# EAGLE design CNYboard (EAGLE 9.5.1)
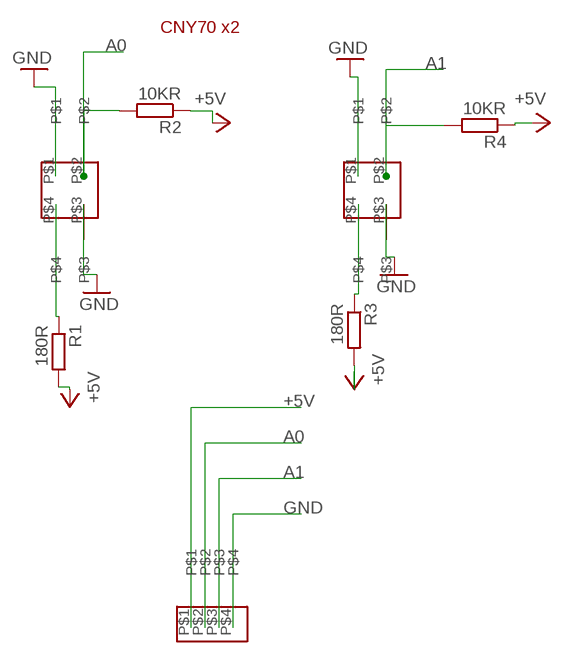
[diagram p0: schematic, sheet 1]

## Parts
R1  180R  R-EU_R0603  [R0603]
R2  10KR  R-EU_R0603  [R0603]
R3  180R  R-EU_R0603  [R0603]
R4  10KR  R-EU_R0603  [R0603]
U$1  CNYSOKET  [CNYSOKET]
U$2  CNYSOKET  [CNYSOKET]
U$3  PIN4  [PIN4]

## Nets
+5V [usbvcc]: R1.2 R2.1 R3.2 R4.1 U$3.P$1
A0: R2.2 U$1.P$2 U$3.P$2
A1: R4.2 U$2.P$2 U$3.P$3
GND: U$1.P$1 U$1.P$3 U$2.P$1 U$2.P$3 U$3.P$4
N$1: R1.1 U$1.P$4
N$2: R3.1 U$2.P$4

## Notes on the sheet
- CNY70 x2

## Library data of the parts
R1-R4 = rcl:R-EU_: RESISTOR, European symbol; SPICEPREFIX: R
U$1 U$2 = cnysoket:CNYSOKET
U$3 = PIN4:PIN4

## Net classes
3 usbvcc: width 0.254 mm, drill 0.61 mm, clearance 0.254 mm

## Board
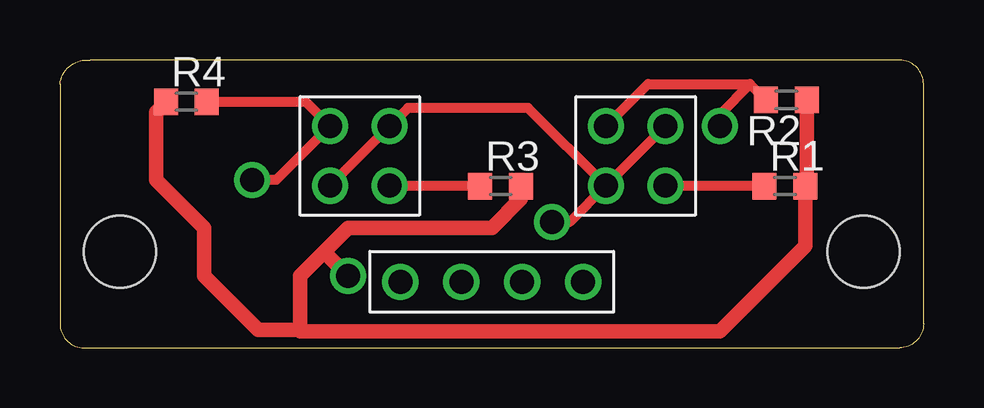
[diagram p1: board, top side]
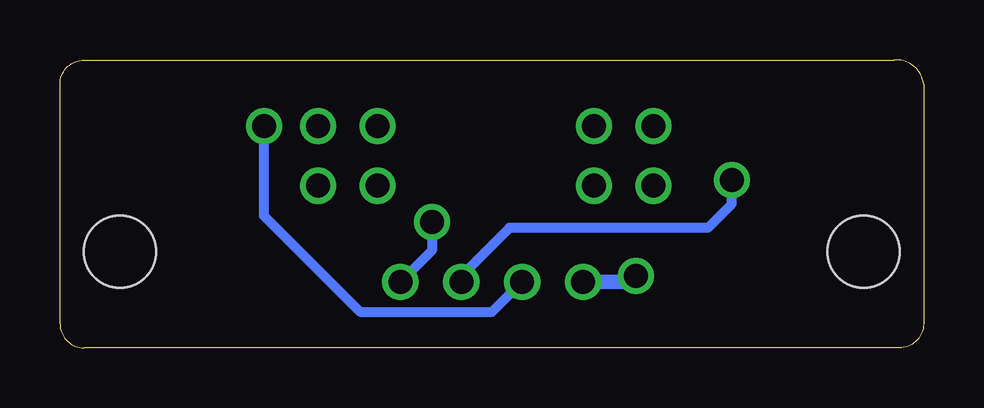
[diagram p2: board, bottom side, seen from below]

Size 36 x 12.01 mm. Coordinates in mm from the lower left corner, seen from the top.
Outline: 1,0 35,0 arc90 36,1 36,11 arc90 35,12 1.25,12 arc90 0,11 0,1 arc90 1,0
Copper layers (1*16): Top 0.035mm / dielectric 1.5mm / Bottom 0.035mm
Design rules "default *": minimum track width 6mil, minimum drill 0.35mm, track to track 6mil, track to pad 6mil, pad to pad 6mil, via to via 6mil, smd to smd 6mil, copper to edge 15mil, drill to drill 6mil, minimum pad ring 10mil, minimum via ring 8mil, stop-mask expansion 4mil, vias tented up to drill 0mil, thermal gap 10mil
Holes 3 mm at 33.5,4 2.5,4

### Footprints (pad centres in the part's own frame; a part is rotated, then mirrored left to right if it is on the bottom)
R0603 = smd 1 x 1.1: 1 -0.85,0; 2 0.85,0
CNYSOKET = drill 1: P$1 -1.24,1.24; P$2 1.24,1.24; P$3 1.24,-1.24; P$4 -1.24,-1.24
PIN4 = drill 1: P$1 -3.81,0; P$2 -1.27,0; P$3 1.27,0; P$4 3.81,0

### Placement (x,y rotation side)
R1  30.22,6.74 0 top
R2  30.28,10.34 180 top
R3  18.37,6.74 0 top
R4  5.27,10.26 0 top
U$1  24,8 90 top
U$2  12.5,8 90 top
U$3  18,2.75 0 top

### Tracks (layer width: path | path; a pad name or v marks a point on that pad's centre or on a via)
+5V  (via drill 1)
  Top 0.61: R2.1 31.13,6.8 R1.2 31.07,4.26 27.5,0.69 16.5,0.69 | 16.5,0.69 | R3.2 19.22,6.22 18,5 12,5 11,4 | 16.5,0.69 10,0.69 10,0.75 | 11,4 10,3 10,0.75 | v12,3 11,4 | R4.1 4,9.84 4,7 6,5 6,3 8.25,0.75 10,0.75
  Bottom 0.61: U$3.P$1 12.25,2.75 v12,3
A0  (via drill 1)
  Top 0.406: U$1.P$2 24.52,11 28.77,11 | R2.2 28.77,11 | 28.77,11 27.5,9.73 v27.5,9.25
  Bottom 0.406: v27.5,9.25 27.5,5.5 23.5,1.5 17.98,1.5 U$3.P$2
A1  (via drill 1)
  Top 0.406: R4.2 10.24,10.26 U$2.P$2 9.02,7 v8,7
  Bottom 0.406: v8,7 8,6 9,5 17.27,5 19.27,3 U$3.P$3
GND  (via drill 1)
  Top 0.406: U$1.P$1 21.25,5.25 v20.5,5.25 | U$2.P$1 U$2.P$3 14.5,10 19.52,10 U$1.P$1 | U$1.P$1 U$1.P$3
  Bottom 0.406: U$3.P$4 20.5,4.06 v20.5,5.25
N$1
  Top 0.406: U$1.P$4 29.35,6.76 R1.1
N$2
  Top 0.406: U$2.P$4 17.5,6.76 R3.1